# Altium schematic sheet Akıllı_Ev.SchDoc
size A3; CompanyName: SACZ; SheetNumber: 1; SheetTotal: 1
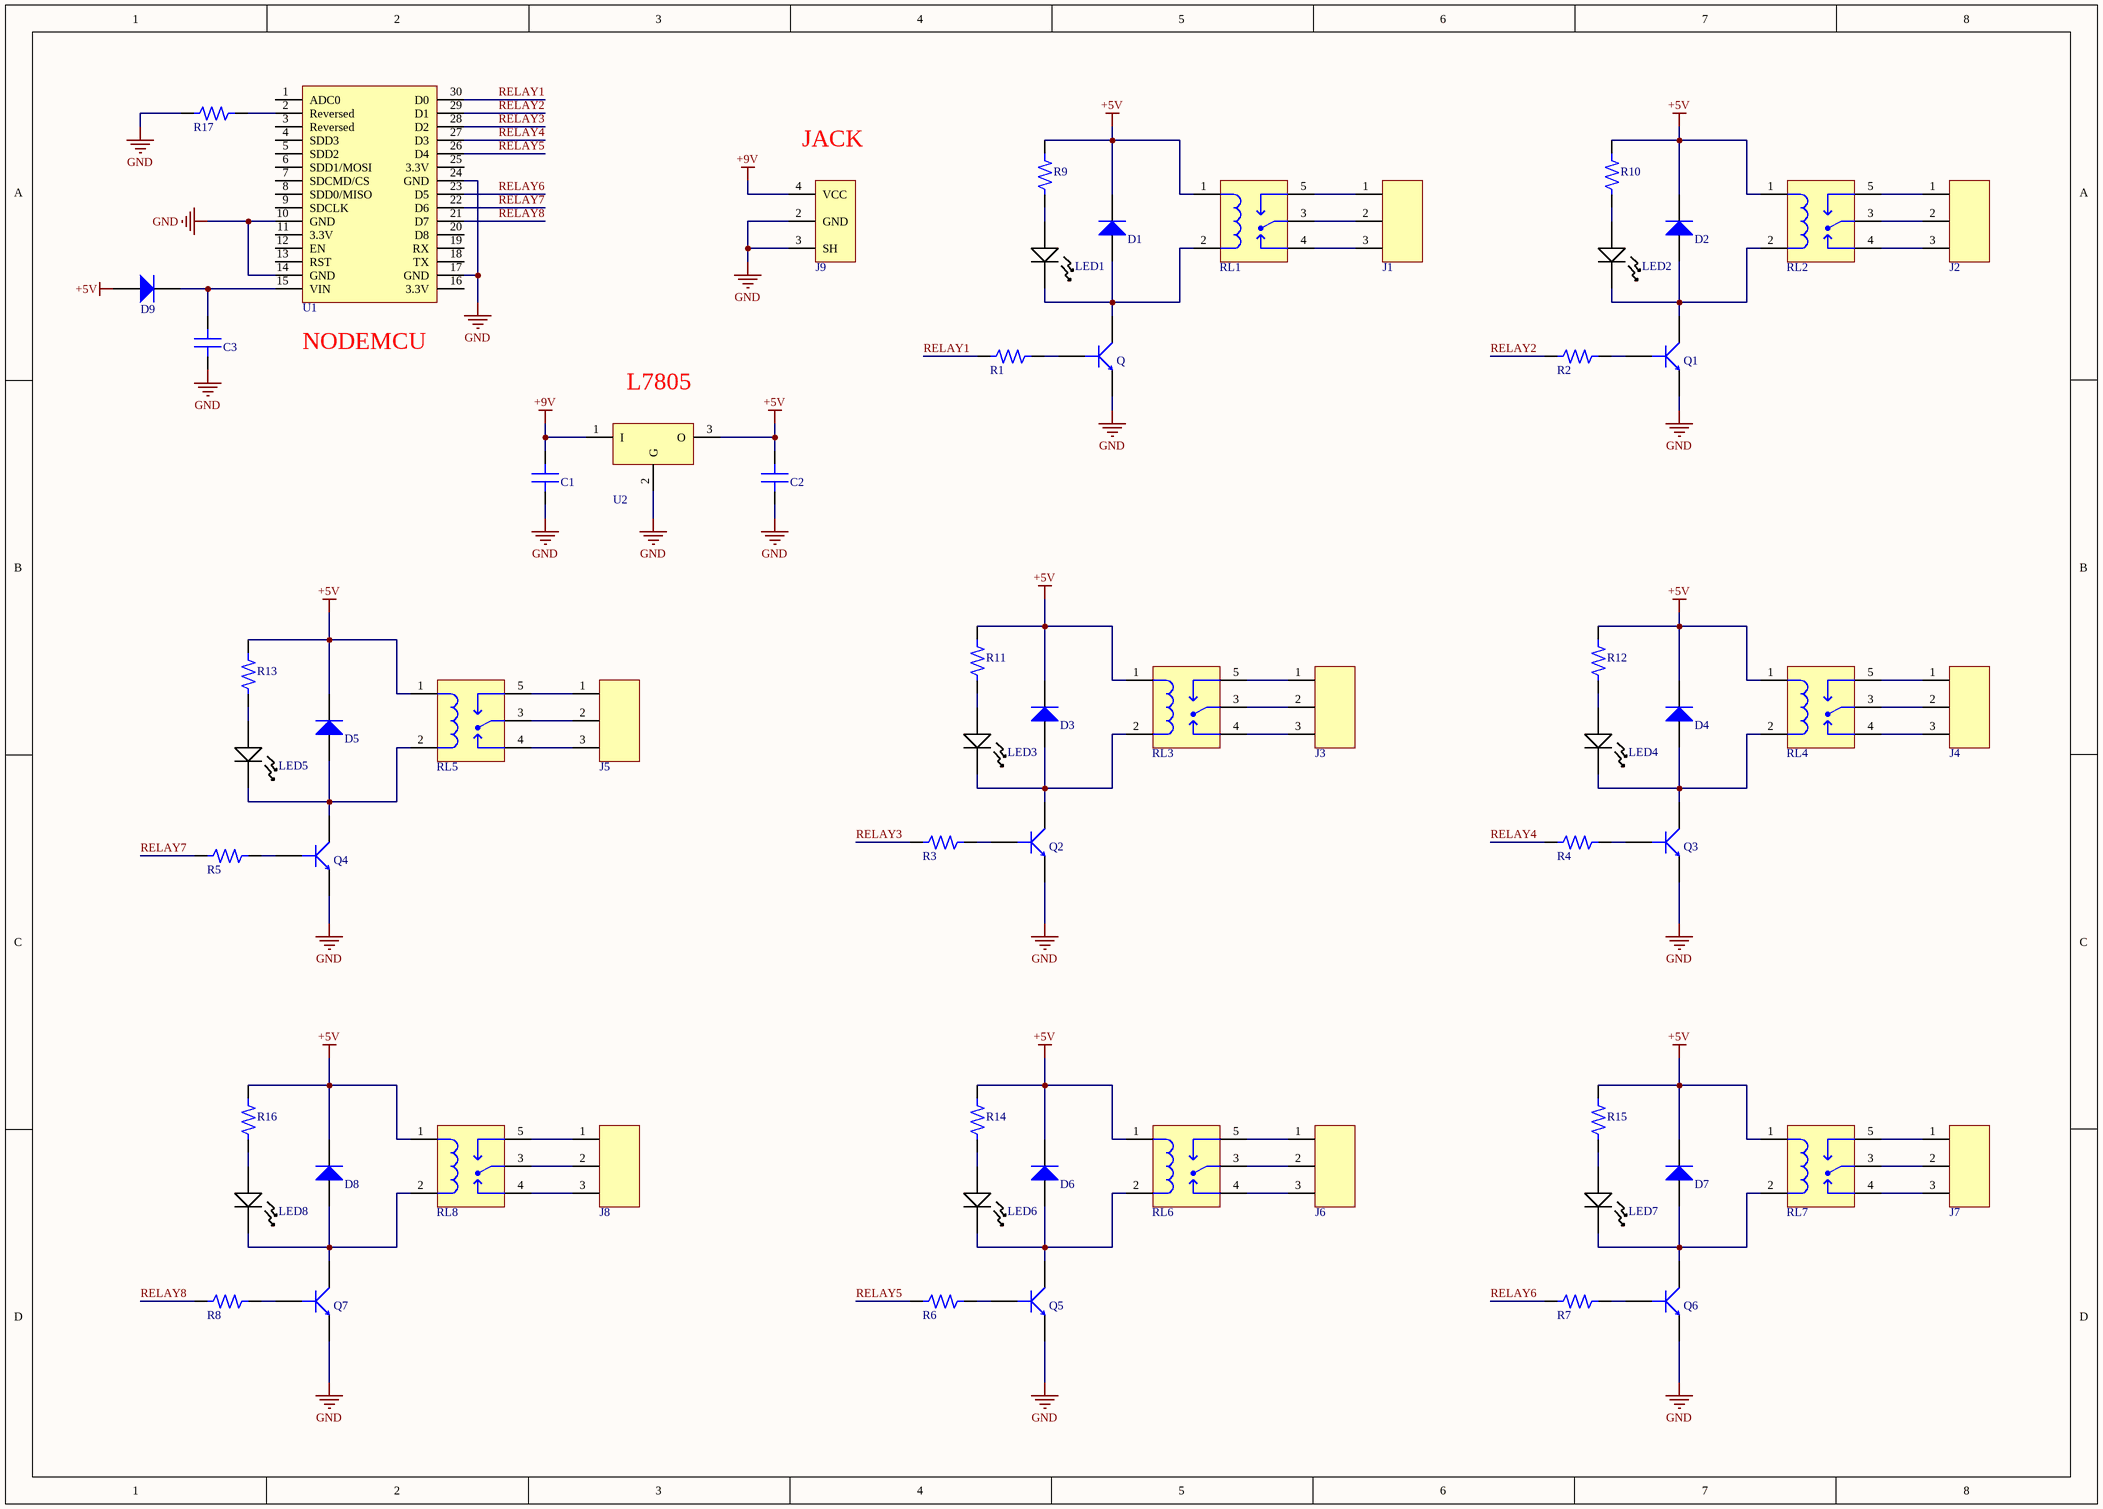
[diagram p0: Akıllı_Ev.SchDoc]

## Parts
C1  100uF  [CAP 100uF]  (value not drawn)
C2  100uF  [CAP 100uF]  (value not drawn)
C3  100nF  [CAP 100nF]  (value not drawn)
D1  1N4007  [DIODE - 1N4007]  (value not drawn)
D2  1N4007  [DIODE - 1N4007]  (value not drawn)
D3  1N4007  [DIODE - 1N4007]  (value not drawn)
D4  1N4007  [DIODE - 1N4007]  (value not drawn)
D5  1N4007  [DIODE - 1N4007]  (value not drawn)
D6  1N4007  [DIODE - 1N4007]  (value not drawn)
D7  1N4007  [DIODE - 1N4007]  (value not drawn)
D8  1N4007  [DIODE - 1N4007]  (value not drawn)
D9  1N4007  [DIODE - 1N4007]  (value not drawn)
J1  HEADER x3  [hEADER X3]  (value not drawn)
J2  HEADER x3  [hEADER X3]  (value not drawn)
J3  HEADER x3  [hEADER X3]  (value not drawn)
J4  HEADER x3  [hEADER X3]  (value not drawn)
J5  HEADER x3  [hEADER X3]  (value not drawn)
J6  HEADER x3  [hEADER X3]  (value not drawn)
J7  HEADER x3  [hEADER X3]  (value not drawn)
J8  HEADER x3  [hEADER X3]  (value not drawn)
J9  JACK  [JACK]  (value not drawn)
LED1  LED RED  [LED]  (value not drawn)
LED2  LED RED  [LED]  (value not drawn)
LED3  LED RED  [LED]  (value not drawn)
LED4  LED RED  [LED]  (value not drawn)
LED5  LED RED  [LED]  (value not drawn)
LED6  LED RED  [LED]  (value not drawn)
LED7  LED RED  [LED]  (value not drawn)
LED8  LED RED  [LED]  (value not drawn)
Q  BC547  [BC547 - NPN]  (value not drawn)
Q1  BC547  [BC547 - NPN]  (value not drawn)
Q2  BC547  [BC547 - NPN]  (value not drawn)
Q3  BC547  [BC547 - NPN]  (value not drawn)
Q4  BC547  [BC547 - NPN]  (value not drawn)
Q5  BC547  [BC547 - NPN]  (value not drawn)
Q6  BC547  [BC547 - NPN]  (value not drawn)
Q7  BC547  [BC547 - NPN]  (value not drawn)
R1  RES 1K OHM  [RES 1K OHM]  (value not drawn)
R2  RES 1K OHM  [RES 1K OHM]  (value not drawn)
R3  RES 1K OHM  [RES 1K OHM]  (value not drawn)
R4  RES 1K OHM  [RES 1K OHM]  (value not drawn)
R5  RES 1K OHM  [RES 1K OHM]  (value not drawn)
R6  RES 1K OHM  [RES 1K OHM]  (value not drawn)
R7  RES 1K OHM  [RES 1K OHM]  (value not drawn)
R8  RES 1K OHM  [RES 1K OHM]  (value not drawn)
R9  RES 470 OHM  [RES 470 OHM]  (value not drawn)
R10  RES 470 OHM  [RES 470 OHM]  (value not drawn)
R11  RES 470 OHM  [RES 470 OHM]  (value not drawn)
R12  RES 470 OHM  [RES 470 OHM]  (value not drawn)
R13  RES 470 OHM  [RES 470 OHM]  (value not drawn)
R14  RES 470 OHM  [RES 470 OHM]  (value not drawn)
R15  RES 470 OHM  [RES 470 OHM]  (value not drawn)
R16  RES 470 OHM  [RES 470 OHM]  (value not drawn)
R17  RES 0603  [RES 0603]  (value not drawn)
RL1  Relay  [RELAY]  (value not drawn)
RL2  Relay  [RELAY]  (value not drawn)
RL3  Relay  [RELAY]  (value not drawn)
RL4  Relay  [RELAY]  (value not drawn)
RL5  Relay  [RELAY]  (value not drawn)
RL6  Relay  [RELAY]  (value not drawn)
RL7  Relay  [RELAY]  (value not drawn)
RL8  Relay  [RELAY]  (value not drawn)
U1  NodeMCU-ESP8266  [NodeMCU-ESP8266]  (value not drawn)
U2  L7805  [L7805]  (value not drawn)

## Nets
+5V: C2.2 D1.2(CATHODE) D2.2(CATHODE) D3.2(CATHODE) D4.2(CATHODE) D5.2(CATHODE) D6.2(CATHODE) D7.2(CATHODE) D8.2(CATHODE) D9.1(ANODE) R9.2 R10.2 R11.2 R12.2 R13.2 R14.2 R15.2 R16.2 RL1.1 RL2.1 RL3.1 RL4.1 RL5.1 RL6.1 RL7.1 RL8.1 U2.3(O)
+9V: C1.2 J9.4(VCC) U2.1(I)
GND: C1.1 C2.1 C3.1 J9.2(GND) J9.3(SH) Q.2(E) Q1.2(E) Q2.2(E) Q3.2(E) Q4.2(E) Q5.2(E) Q6.2(E) Q7.2(E) R17.1 U1.10(GND) U1.14(GND) U1.17(GND) U1.24(GND) U2.2(G)
RELAY1: R1.1 U1.30(D0)
RELAY2: R2.1 U1.29(D1)
RELAY3: R3.1 U1.28(D2)
RELAY4: R4.1 U1.27(D3)
RELAY5: R6.1 U1.26(D4)
RELAY6: R7.1 U1.23(D5)
RELAY7: R5.1 U1.22(D6)
RELAY8: R8.1 U1.21(D7)
NetC3_2: C3.2 D9.2(CATHODE) U1.15(VIN)
NetD1_1: D1.1(ANODE) LED1.2 Q.3(C) RL1.2
NetD2_1: D2.1(ANODE) LED2.2 Q1.3(C) RL2.2
NetD3_1: D3.1(ANODE) LED3.2 Q2.3(C) RL3.2
NetD4_1: D4.1(ANODE) LED4.2 Q3.3(C) RL4.2
NetD5_1: D5.1(ANODE) LED5.2 Q4.3(C) RL5.2
NetD6_1: D6.1(ANODE) LED6.2 Q5.3(C) RL6.2
NetD7_1: D7.1(ANODE) LED7.2 Q6.3(C) RL7.2
NetD8_1: D8.1(ANODE) LED8.2 Q7.3(C) RL8.2
NetJ1_1: J1.1 RL1.5
NetJ1_2: J1.2 RL1.3
NetJ1_3: J1.3 RL1.4
NetJ2_1: J2.1 RL2.5
NetJ2_2: J2.2 RL2.3
NetJ2_3: J2.3 RL2.4
NetJ3_1: J3.1 RL3.5
NetJ3_2: J3.2 RL3.3
NetJ3_3: J3.3 RL3.4
NetJ4_1: J4.1 RL4.5
NetJ4_2: J4.2 RL4.3
NetJ4_3: J4.3 RL4.4
NetJ5_1: J5.1 RL5.5
NetJ5_2: J5.2 RL5.3
NetJ5_3: J5.3 RL5.4
NetJ6_1: J6.1 RL6.5
NetJ6_2: J6.2 RL6.3
NetJ6_3: J6.3 RL6.4
NetJ7_1: J7.1 RL7.5
NetJ7_2: J7.2 RL7.3
NetJ7_3: J7.3 RL7.4
NetJ8_1: J8.1 RL8.5
NetJ8_2: J8.2 RL8.3
NetJ8_3: J8.3 RL8.4
NetLED1_1: LED1.1 R9.1
NetLED2_1: LED2.1 R10.1
NetLED3_1: LED3.1 R11.1
NetLED4_1: LED4.1 R12.1
NetLED5_1: LED5.1 R13.1
NetLED6_1: LED6.1 R14.1
NetLED7_1: LED7.1 R15.1
NetLED8_1: LED8.1 R16.1
NetQ1_1: Q1.1(B) R2.2
NetQ2_1: Q2.1(B) R3.2
NetQ3_1: Q3.1(B) R4.2
NetQ4_1: Q4.1(B) R5.2
NetQ5_1: Q5.1(B) R6.2
NetQ6_1: Q6.1(B) R7.2
NetQ7_1: Q7.1(B) R8.2
NetQ_1: Q.1(B) R1.2
NetR17_2: R17.2 U1.2(Reversed)

Not connected (* = marked no-connect by the designer): U1 1(ADC0) 3(Reversed) 4(SDD3) 5(SDD2) 6(SDD1/MOSI) 7(SDCMD/CS) 8(SDD0/MISO) 9(SDCLK) 11(3.3V) 12(EN) 13(RST) 16(3.3V) 18(TX) 19(RX) 20(D8) 25(3.3V)

## Notes on the sheet
- (near J9) JACK
- Dalgalanmaların engellenmesi için güçlü kondansatör (decoupling cap) kullanılmalı, ne kadar büyük sığa değeri olursa o kadar iyi. Çünkü voltaj ne kadar dalgalanırsa regülatör de o kadar ısınır ve parlar.
  NodeMCU nun Vin ine 47uF | 100nF mercimek cap olur
  Regülatörün iki tarafındaki cap değerleri 100uF (alüminyum cap) olabilir ideal.
- (near U1) NODEMCU
- (near U2) L7805
- TANIM / DESCRIPTION
- DOSYA ADI / FILE NAME
- HAZIRLAYAN / PREPARED BY
- KONTROL EDEN / CHECKED BY
- YAYIN TARİHİ / REL DATE
- COMPANY NAME
- ONAYLAYAN / APPROVED BY
- ELECTRICAL - ELECTRONICS
- BÖLÜM  DEPARTMENT
- BOYUT / SIZE
- REVİZYON / REVISION
- SAYFA / SHEET
- ENGINEERING
- /

## Library data of the parts
C1 C2 = CAP 100uF
C3 = CAP 100nF
D1-D9 = Diode 1N4007: 1N4007 Rectifier Diode 1 A 1000 V DO-41 Axial 4007 1 amp 1000 Volt Electronic Silicon Diodes
J1-J8 = HEADER x3: TERM BLK 3POS SIDE ENT 3.5MM PCB
J9 = JACK: 5.5 x 2.1 mm DC güç jak soketi
Q Q1-Q7 = NPN Transistor BC547
R1-R8 = RES 1K OHM: Resistor thru-hole Axial 0.4
R9-R16 = RES 470 OHM: Resistor thru-hole Axial 0.4
RL1-RL8 = Relay: SPDT 5V RELAY
U1 = NodeMCU-ESP8266: HiLetgo 3pcs ESP8266 NodeMCU CP2102 ESP-12E Development Board Open Source Serial Module Works Great for Arduino IDE/Micropython (Large)
U2 = L7805: 5V REG